# Altium project Zynq 7000 Demo.PrjPcb (part 5 of 9)

## Sheet [8] - Z7010 B34, AR238, MIPI.SchDoc: BANK 34, MIPI & AR238
size B; Organization: Altium Limited; Address1: L3, 12a Rodborough Rd; Address2: Frenchs Forest; Address3: NSW; Address4: Australia 2086; DocumentNumber: 8; Revision: V1I1; SheetNumber: 8; SheetTotal: 16
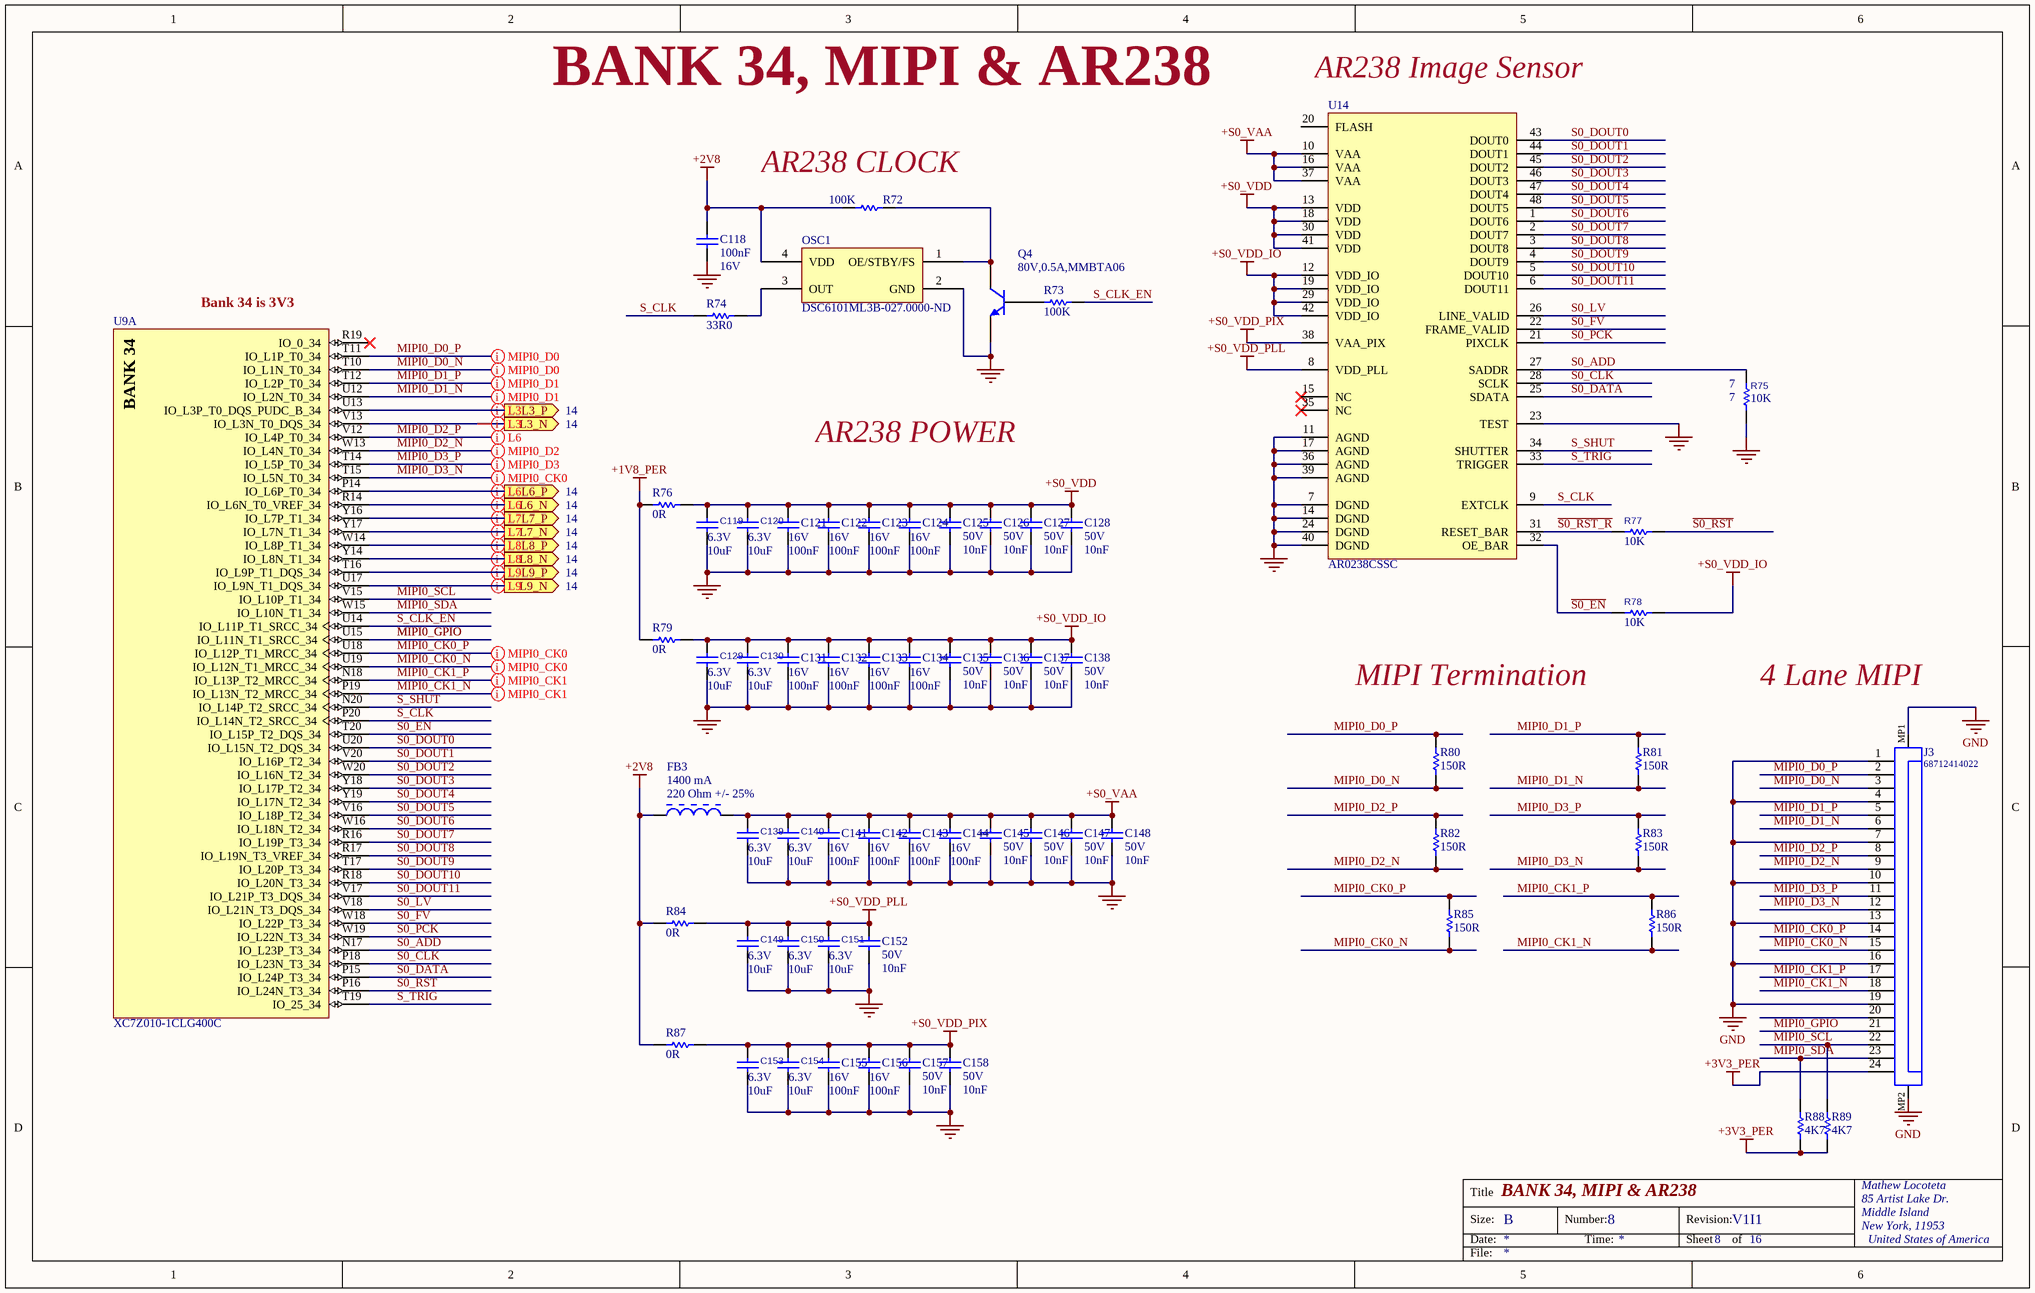
[diagram p7: [8] - Z7010 B34, AR238, MIPI.SchDoc]

### Parts
C118  Capacitance: 100nF  Voltage Rating: 16V  [C0402]  (hidden comment: 0.1uF,16V)
C119  Capacitance: 10uF  Voltage Rating: 6.3V  [C0603]  (hidden comment: 10uF,6V3)
C120  Capacitance: 10uF  Voltage Rating: 6.3V  [C0603]  (hidden comment: 10uF,6V3)
C121  Capacitance: 100nF  Voltage Rating: 16V  [C0402]  (hidden comment: 0.1uF,16V)
C122  Capacitance: 100nF  Voltage Rating: 16V  [C0402]  (hidden comment: 0.1uF,16V)
C123  Capacitance: 100nF  Voltage Rating: 16V  [C0402]  (hidden comment: 0.1uF,16V)
C124  Capacitance: 100nF  Voltage Rating: 16V  [C0402]  (hidden comment: 0.1uF,16V)
C125  Voltage Rating (DC): 50V  Capacitance: 10nF  [CAPC1005X55X25ML5T10]  (hidden comment: CC0402KRX7R9BB103)
C126  Voltage Rating (DC): 50V  Capacitance: 10nF  [CAPC1005X55X25ML5T10]  (hidden comment: CC0402KRX7R9BB103)
C127  Voltage Rating (DC): 50V  Capacitance: 10nF  [CAPC1005X55X25ML5T10]  (hidden comment: CC0402KRX7R9BB103)
C128  Voltage Rating (DC): 50V  Capacitance: 10nF  [CAPC1005X55X25ML5T10]  (hidden comment: CC0402KRX7R9BB103)
C129  Capacitance: 10uF  Voltage Rating: 6.3V  [C0603]  (hidden comment: 10uF,6V3)
C130  Capacitance: 10uF  Voltage Rating: 6.3V  [C0603]  (hidden comment: 10uF,6V3)
C131  Capacitance: 100nF  Voltage Rating: 16V  [C0402]  (hidden comment: 0.1uF,16V)
C132  Capacitance: 100nF  Voltage Rating: 16V  [C0402]  (hidden comment: 0.1uF,16V)
C133  Capacitance: 100nF  Voltage Rating: 16V  [C0402]  (hidden comment: 0.1uF,16V)
C134  Capacitance: 100nF  Voltage Rating: 16V  [C0402]  (hidden comment: 0.1uF,16V)
C135  Voltage Rating (DC): 50V  Capacitance: 10nF  [CAPC1005X55X25ML5T10]  (hidden comment: CC0402KRX7R9BB103)
C136  Voltage Rating (DC): 50V  Capacitance: 10nF  [CAPC1005X55X25ML5T10]  (hidden comment: CC0402KRX7R9BB103)
C137  Voltage Rating (DC): 50V  Capacitance: 10nF  [CAPC1005X55X25ML5T10]  (hidden comment: CC0402KRX7R9BB103)
C138  Voltage Rating (DC): 50V  Capacitance: 10nF  [CAPC1005X55X25ML5T10]  (hidden comment: CC0402KRX7R9BB103)
C139  Capacitance: 10uF  Voltage Rating: 6.3V  [C0603]  (hidden comment: 10uF,6V3)
C140  Capacitance: 10uF  Voltage Rating: 6.3V  [C0603]  (hidden comment: 10uF,6V3)
C141  Capacitance: 100nF  Voltage Rating: 16V  [C0402]  (hidden comment: 0.1uF,16V)
C142  Capacitance: 100nF  Voltage Rating: 16V  [C0402]  (hidden comment: 0.1uF,16V)
C143  Capacitance: 100nF  Voltage Rating: 16V  [C0402]  (hidden comment: 0.1uF,16V)
C144  Capacitance: 100nF  Voltage Rating: 16V  [C0402]  (hidden comment: 0.1uF,16V)
C145  Voltage Rating (DC): 50V  Capacitance: 10nF  [CAPC1005X55X25ML5T10]  (hidden comment: CC0402KRX7R9BB103)
C146  Voltage Rating (DC): 50V  Capacitance: 10nF  [CAPC1005X55X25ML5T10]  (hidden comment: CC0402KRX7R9BB103)
C147  Voltage Rating (DC): 50V  Capacitance: 10nF  [CAPC1005X55X25ML5T10]  (hidden comment: CC0402KRX7R9BB103)
C148  Voltage Rating (DC): 50V  Capacitance: 10nF  [CAPC1005X55X25ML5T10]  (hidden comment: CC0402KRX7R9BB103)
C149  Capacitance: 10uF  Voltage Rating: 6.3V  [C0603]  (hidden comment: 10uF,6V3)
C150  Capacitance: 10uF  Voltage Rating: 6.3V  [C0603]  (hidden comment: 10uF,6V3)
C151  Capacitance: 10uF  Voltage Rating: 6.3V  [C0603]  (hidden comment: 10uF,6V3)
C152  Voltage Rating (DC): 50V  Capacitance: 10nF  [CAPC1005X55X25ML5T10]  (hidden comment: CC0402KRX7R9BB103)
C153  Capacitance: 10uF  Voltage Rating: 6.3V  [C0603]  (hidden comment: 10uF,6V3)
C154  Capacitance: 10uF  Voltage Rating: 6.3V  [C0603]  (hidden comment: 10uF,6V3)
C155  Capacitance: 100nF  Voltage Rating: 16V  [C0402]  (hidden comment: 0.1uF,16V)
C156  Capacitance: 100nF  Voltage Rating: 16V  [C0402]  (hidden comment: 0.1uF,16V)
C157  Voltage Rating (DC): 50V  Capacitance: 10nF  [CAPC1005X55X25ML5T10]  (hidden comment: CC0402KRX7R9BB103)
C158  Voltage Rating (DC): 50V  Capacitance: 10nF  [CAPC1005X55X25ML5T10]  (hidden comment: CC0402KRX7R9BB103)
FB3  Rated Current: 1400 mA  Impedance (at 100 MHz): 220 Ohm +/- 25%  [MURA-BLM18PG_KG-CHIP-2_V2]  (hidden comment: BLM18PG221SN1D)
J3  68712414022  [68712414022]
OSC1  DSC6101ML3B-027.0000-ND  [4-VFLGA]
Q4  80V,0.5A,MMBTA06  [ONSC-SOT-23-3-318-08_V]
R72  100K  [R0402]
R73  100K  [R0402]
R74  33R0  [R0603]
R75  10K  [R0402]
R76  0R  [R0402]
R77  10K  [R0402]
R78  10K  [R0402]
R79  0R  [R0402]
R80  value 150R  [RESC1005X40X25LL05T05]  (hidden comment: CRCW0402150RFKED)
R81  value 150R  [RESC1005X40X25LL05T05]  (hidden comment: CRCW0402150RFKED)
R82  value 150R  [RESC1005X40X25LL05T05]  (hidden comment: CRCW0402150RFKED)
R83  value 150R  [RESC1005X40X25LL05T05]  (hidden comment: CRCW0402150RFKED)
R84  0R  [R0402]
R85  value 150R  [RESC1005X40X25LL05T05]  (hidden comment: CRCW0402150RFKED)
R86  value 150R  [RESC1005X40X25LL05T05]  (hidden comment: CRCW0402150RFKED)
R87  0R  [R0402]
R88  Resistance: 4K7  (hidden comment: 4K7 0402 1%)
R89  Resistance: 4K7  (hidden comment: 4K7 0402 1%)
U9  XC7Z010-1CLG400C  [CLG400]  (part A of 9)
U14  AR0238CSSC

### Ports
L3_N (out), L3_P (out), L6_N (out), L6_P (out), L7_N (out), L7_P (out), L8_N (out), L8_P (out), L9_N (out), L9_P (out)

### Nets
+1V8_PER: R76.1 R79.1
+2V8: C118.1 FB3.1 OSC1.4(VDD) R72.1 R84.1 R87.1
+3V3_PER: J3.24 R88.2 R89.2
+S0_VAA: C139.2 C140.2 C141.2 C142.2 C143.2 C144.2 C145.2 C146.2 C147.2 C148.2 FB3.2 U14.10(VAA) U14.16(VAA) U14.37(VAA)
+S0_VDD: C119.2 C120.2 C121.2 C122.2 C123.2 C124.2 C125.2 C126.2 C127.2 C128.2 R76.2 U14.13(VDD) U14.18(VDD) U14.30(VDD) U14.41(VDD)
+S0_VDD_IO: C129.2 C130.2 C131.2 C132.2 C133.2 C134.2 C135.2 C136.2 C137.2 C138.2 R78.2 R79.2 U14.12(VDD_IO) U14.19(VDD_IO) U14.29(VDD_IO) U14.42(VDD_IO)
+S0_VDD_PIX: C153.2 C154.2 C155.2 C156.2 C157.2 C158.2 R87.2 U14.38(VAA_PIX)
+S0_VDD_PLL: C149.2 C150.2 C151.2 C152.2 R84.2 U14.8(VDD_PLL)
GND: C118.2 C119.1 C120.1 C121.1 C122.1 C123.1 C124.1 C125.1 C126.1 C127.1 C128.1 C129.1 C130.1 C131.1 C132.1 C133.1 C134.1 C135.1 C136.1 C137.1 C138.1 C139.1 C140.1 C141.1 C142.1 C143.1 C144.1 C145.1 C146.1 C147.1 C148.1 C149.1 C150.1 C151.1 C152.1 C153.1 C154.1 C155.1 C156.1 C157.1 C158.1 J3.1 J3.4 J3.7 J3.10 J3.13 J3.16 J3.19 J3.MP1 J3.MP2 OSC1.2(GND) Q4.2(E) R75.1 U14.7(DGND) U14.11(AGND) U14.14(DGND) U14.17(AGND) U14.23(TEST) U14.24(DGND) U14.36(AGND) U14.39(AGND) U14.40(DGND)
L3_N: U9.V13(IO_L3N_T0_DQS_34) ; port L3_N
L3_P: U9.U13(IO_L3P_T0_DQS_PUDC_B_34) ; port L3_P
L6_N: U9.R14(IO_L6N_T0_VREF_34) ; port L6_N
L6_P: U9.P14(IO_L6P_T0_34) ; port L6_P
L7_N: U9.Y17(IO_L7N_T1_34) ; port L7_N
L7_P: U9.Y16(IO_L7P_T1_34) ; port L7_P
L8_N: U9.Y14(IO_L8N_T1_34) ; port L8_N
L8_P: U9.W14(IO_L8P_T1_34) ; port L8_P
L9_N: U9.U17(IO_L9N_T1_DQS_34) ; port L9_N
L9_P: U9.T16(IO_L9P_T1_DQS_34) ; port L9_P
MIPI0_CK0_N: J3.15 R85.1 U9.U19(IO_L12N_T1_MRCC_34)
MIPI0_CK0_P: J3.14 R85.2 U9.U18(IO_L12P_T1_MRCC_34)
MIPI0_CK1_N: J3.18 R86.1 U9.P19(IO_L13N_T2_MRCC_34)
MIPI0_CK1_P: J3.17 R86.2 U9.N18(IO_L13P_T2_MRCC_34)
MIPI0_D0_N: J3.3 R80.1 U9.T10(IO_L1N_T0_34)
MIPI0_D0_P: J3.2 R80.2 U9.T11(IO_L1P_T0_34)
MIPI0_D1_N: J3.6 R81.1 U9.U12(IO_L2N_T0_34)
MIPI0_D1_P: J3.5 R81.2 U9.T12(IO_L2P_T0_34)
MIPI0_D2_N: J3.9 R82.1 U9.W13(IO_L4N_T0_34)
MIPI0_D2_P: J3.8 R82.2 U9.V12(IO_L4P_T0_34)
MIPI0_D3_N: J3.12 R83.1 U9.T15(IO_L5N_T0_34)
MIPI0_D3_P: J3.11 R83.2 U9.T14(IO_L5P_T0_34)
MIPI0_GPIO: J3.21 U9.U15(IO_L11N_T1_SRCC_34)
MIPI0_SCL: J3.22 R89.1 U9.V15(IO_L10P_T1_34)
MIPI0_SDA: J3.23 R88.1 U9.W15(IO_L10N_T1_34)
S0_ADD: R75.2 U9.N17(IO_L23P_T3_34) U14.27(SADDR)
S0_CLK: U9.P18(IO_L23N_T3_34) U14.28(SCLK)
S0_DATA: U9.P15(IO_L24P_T3_34) U14.25(SDATA)
S0_DOUT0: U9.U20(IO_L15N_T2_DQS_34) U14.43(DOUT0)
S0_DOUT1: U9.V20(IO_L16P_T2_34) U14.44(DOUT1)
S0_DOUT2: U9.W20(IO_L16N_T2_34) U14.45(DOUT2)
S0_DOUT3: U9.Y18(IO_L17P_T2_34) U14.46(DOUT3)
S0_DOUT4: U9.Y19(IO_L17N_T2_34) U14.47(DOUT4)
S0_DOUT5: U9.V16(IO_L18P_T2_34) U14.48(DOUT5)
S0_DOUT6: U9.W16(IO_L18N_T2_34) U14.1(DOUT6)
S0_DOUT7: U9.R16(IO_L19P_T3_34) U14.2(DOUT7)
S0_DOUT8: U9.R17(IO_L19N_T3_VREF_34) U14.3(DOUT8)
S0_DOUT9: U9.T17(IO_L20P_T3_34) U14.4(DOUT9)
S0_DOUT10: U9.R18(IO_L20N_T3_34) U14.5(DOUT10)
S0_DOUT11: U9.V17(IO_L21P_T3_DQS_34) U14.6(DOUT11)
S0_FV: U9.W18(IO_L22P_T3_34) U14.22(FRAME_VALID)
S0_LV: U9.V18(IO_L21N_T3_DQS_34) U14.26(LINE_VALID)
S0_PCK: U9.W19(IO_L22N_T3_34) U14.21(PIXCLK)
~{S0_EN}: R78.1 U9.T20(IO_L15P_T2_DQS_34) U14.32(OE_BAR)
~{S0_RST}: R77.2 U9.P16(IO_L24N_T3_34)
~{S0_RST_R}: R77.1 U14.31(RESET_BAR)
S_CLK: R74.1 U9.P20(IO_L14N_T2_SRCC_34) U14.9(EXTCLK)
S_CLK_EN: R73.2 U9.U14(IO_L11P_T1_SRCC_34)
S_SHUT: U9.N20(IO_L14P_T2_SRCC_34) U14.34(SHUTTER)
S_TRIG: U9.T19(IO_25_34) U14.33(TRIGGER)
NetOSC1_1: OSC1.1(OE/STBY/FS) Q4.3(C) R72.2
NetOSC1_3: OSC1.3(OUT) R74.2
NetQ4_1: Q4.1(B) R73.1

Not connected (* = marked no-connect by the designer): J3 20; U9 R19(IO_0_34)*; U14 15(NC)* 20(FLASH) 35(NC)*

### Layout directives
differential pair: L3_N, L3_P, L6_N, L6_P, L7_N, L7_P, L8_N, L8_P, L9_N, L9_P, MIPI0_CK0_N, MIPI0_CK0_P, MIPI0_CK1_N, MIPI0_CK1_P, MIPI0_D0_N, MIPI0_D0_P, MIPI0_D1_N, MIPI0_D1_P, MIPI0_D2_N, MIPI0_D2_P, MIPI0_D3_N, MIPI0_D3_P

### Notes on the sheet
- BANK 34, MIPI & AR238
- (near U14) AR238 Image Sensor
- (near R72) AR238 CLOCK
- (near U9) Bank 34 is 3V3
- 14
- (near R75) 7
- AR238 POWER
- MIPI Termination
- 4 Lane MIPI
- Title
- Size:
- Date:
- B
- Number:
- Time:
- Revision:
- Sheet
- of
- Mathew Locoteta
- 85 Artist Lake Dr.
- Middle Island
- New York, 11953
- United States of America
- File:
- (in symbol CMP-0363-00007-3, part A) BANK 34

### Library data of the parts
C118 C121-C124 C131-C134 C141-C144 C155 C156 = CL05B104KO5VPNC: CAP CER 0.1UF 16V X7R 0402; Manufacturer: Samsung; Tolerance: 10%; Supplier 1: Digi-Key; Manufacturer Part Number: CL05B104KO5VPNC; Stock 1: 940680; Pricing 1: 1=0.10000, 10=0.02600, 100=0.01140, 500=0.00812, 1000=0.00638, 2500=0.00580, 5000=0.00534 (USD); RoHS: Yes; Mount: Surface Mount; Case/Package: 0402; Case Code (Metric): 1005; Case Code (Imperial): 0402; Min Operating Temperature: -55°C; Max Operating Temperature: 125°C; Packaging: Cut Tape; Features: Soft Termination; Length: 0.039inch; Width: 0.02inch; Thickness: 0.022inch; Ratings: AEC-Q200; Lead Free: Lead Free; ComponentLink1URL: http://components.arrow.com/part/dataview/0323_06933256?src-supplier=Arrow+Europe; ComponentLink1Description: http://components.arrow.com/part/dataview/0323_06933256?src-supplier=Arrow+Europe; ComponentLink2URL: http://www.samsungsem.com/kr/support/library/product-catalog/mlcc.jsp?src-supplier=Digi-Key; ComponentLink2Description: http://www.samsungsem.com/kr/support/library/product-catalog/mlcc.jsp?src-supplier=Digi-Key; ComponentLink3URL: http://www.farnell.com/datasheets/2710692.pdf?src-supplier=Newark; ComponentLink3Description: http://www.farnell.com/datasheets/2710692.pdf?src-supplier=Newark; ComponentLink4URL: http://www.samsungsem.com/kr/support/product-search/mlcc/CL05B104KO5VPNC.jsp?src-supplier=Digi-Key; ComponentLink4Description: http://www.samsungsem.com/kr/support/product-search/mlcc/CL05B104KO5VPNC.jsp?src-supplier=Digi-Key; ComponentLink5URL: http://www.samsungsem.com/servlet/FileDownload?type=spec&file=CL05B104KO5VPNC.pdf&src-supplier=Avnet; ComponentLink5Description: http://www.samsungsem.com/servlet/FileDownload?type=spec&file=CL05B104KO5VPNC.pdf&src-supplier=Avnet; Supplier Part Number 1: 1276-6844-1-ND
C119 C120 C129 C130 C139 C140 C149-C151 C153 C154 = JMK107ABJ106MAHT: CAP CER 10UF 6.3V X5R 0603; Manufacturer: Taiyo Yuden; Tolerance: 20%; Supplier 1: Digi-Key; Manufacturer Part Number: JMK107ABJ106MAHT; Stock 1: 454858; Pricing 1: 1=0.20000, 10=0.13700, 100=0.06920, 500=0.04736, 1000=0.04190 (USD); RoHS: Yes; Mount: Surface Mount; Case/Package: 0603; Case Code (Imperial): 0603; Case Code (Metric): 1608; Contact Plating: Tin; Min Operating Temperature: -55°C; Max Operating Temperature: 85°C; Packaging: Tape and Reel; Voltage Rating (DC): 6.3V; Package Quantity: 4000; Dielectric: X5R; Termination: SMD/SMT; Length: 1.6mm; Height: 0.8mm; Width: 0.8mm; Thickness: 0.035inch; Ratings: AEC-Q200; Lead Free: Lead Free; Halogen Free: Halogen Free; ComponentLink1URL: https://datasheet.ciiva.com/18697/mlcc01-hq-e-18697804.pdf?src-supplier=Digi-Key; ComponentLink1Description: https://datasheet.ciiva.com/18697/mlcc01-hq-e-18697804.pdf?src-supplier=Digi-Key; ComponentLink2URL: https://datasheet.ciiva.com/18697/mlcc01-hq-e-18697806.pdf?src-supplier=Digi-Key; ComponentLink2Description: https://datasheet.ciiva.com/18697/mlcc01-hq-e-18697806.pdf?src-supplier=Digi-Key; ComponentLink3URL: https://datasheet.ciiva.com/18697/mlcc01-hq-e-18697805.pdf?src-supplier=Digi-Key; ComponentLink3Description: https://datasheet.ciiva.com/18697/mlcc01-hq-e-18697805.pdf?src-supplier=Digi-Key; Supplier Part Number 1: 587-3383-1-ND
C125-C128 C135-C138 C145-C148 C152 C157 C158 = CMP-2100-03592-1: Chip Capacitor, 10 nF, +/- 10%, 50 V, -55 to 125 degC, 0402 (1005 Metric), RoHS, Tape and Reel; Manufacturer: Yageo; Dielectric: X7R; Package Description: 2-Pin Surface Mount Device, Body 1 x 0.5 mm; REACH SVHC: NoSVHC; Depth: 0.5mm; Length: 1mm; Tolerance: 10%; Radiation Hardening: No; Thickness: 0.022inch; Lead Free: LeadFree; Height: 0.5mm; Packaging: TapeandReel; RoHSCompliant: True; Termination: SMD/SMT; Min Operating Temperature: -55degC; Composition: Ceramic; Case Code (Metric): 1005; Voltage Rating: 50V; Case Code (Imperial): 0402; Mount: SurfaceMount; Package Reference: 0402; Voltage: 50V; Manufacturer URL: http://www.yageo.com/; Width: 0.5mm; Package Quantity: 1; Datasheet Version: Rev. 15, 10/2016; Max Operating Temperature: 125degC; Datasheet URL: http://www.yageo.com/documents/recent/UPY-GPHC_X7R_6.3V-to-50V_15.pdf; Case/Package: 0402
FB3 = CMP-0686-00569-2: Chip Ferrite Bead for Power Lines, 220 Ohm, 1400 mA, -55 to 125 degC, 1.6 x 0.8 x 0.95 mm SMD, Tape and Reel; Manufacturer: Murata; DC Resistance: 0.10 Ohm Max.; ComponentLink2URL: http://www.murata.com/products/catalog/pdf/c31e.pdf; Packing: Tape and Reel; ComponentLink3URL: http://www.murata.com/products/catalog/pdf/c31e.pdf; PackageDescription: 2-Pin Chip, Body 1.6 x 0.8 mm; ComponentLink1Description: Manufacturer URL; ComponentLink2Description: Datasheet; Operating Temperature Range: -55 to 125 degC; DatasheetVersion: 08/2013; PackageReference: BLM18_H950-2; Mounting Technology: Surface Mount; ComponentLink1URL: http://www.murata.com/; ComponentLink3Description: Package Specification; PartNumber: BLM18PG221SN1D
J3 = CMP-1502-01558-1: SMT ZIF Connectors WR-FPC, Horizontal, Top Contact, pitch 0.5 mm, 24 pins; Manufacturer: Wurth Elektronik; Rated Current: 0.5A; Pin Number: 24; Pitch: 0.5mm; Working Voltage: 50VAC; Contact Resistance: 20mOhm; Withstanding Voltage: 250VAC; Packaging: TapeandReel; Operating Temperature: -25to85degC; Manufacturer URL: http://www.we-online.de; Mounting Technology: SMT; Package Reference: 68712414022; Orientation: Horizontal; Datasheet URL: https://katalog.we-online.de/em/datasheet/68712414022.pdf; Contact Design: TopContact; Part Number: 68712414022; Publisher: WurthElektronik
OSC1 = DSC6101CI2A-027.0000: ULTRA-LOW POWER,MEMS OSCILLATOR, / DSC6101ML3B-027.0000-ND / USE B VERSION 4-VFLGA 2MMx1.6MM; Manufacturer: Microchip; Frequency: 27MHz; Max Supply Current: 3mA; Frequency Stability: 25ppm; Manufacturer Part Number: DSC6101CI2A-027.0000; RoHS: Yes; Mount: Surface Mount; Case/Package: SMD/SMT; Min Operating Temperature: -40°C; Max Operating Temperature: 85°C; Packaging: Rail/Tube; Length: 0.126inch; Height: 0.035inch; Width: 0.098inch; Ratings: AEC-Q100; ComponentLink1URL: http://www.microchip.com/mymicrochip/filehandler.aspx?ddocname=en587492&src-supplier=Digi-Key; ComponentLink1Description: http://www.microchip.com/mymicrochip/filehandler.aspx?ddocname=en587492&src-supplier=Digi-Key; Supplier 1: Mouser; Supplier Part Number 1: 579-6101ML3B0270000
Q4 = MMBTA06LT1G: TRANS NPN 80V 0.5A SOT23; Manufacturer: ON Semiconductor; Max Power Dissipation: 225mW; Number of Elements: 1; Frequency: 100MHz; Emitter Base Voltage (VEBO): 4V; Collector Emitter Saturation Voltage: 250mV; Max Collector Current: 500mA; Power Dissipation: 300mW; Element Configuration: Single; hFE Min: 100; Supplier 1: Digi-Key; Manufacturer Part Number: MMBTA06LT1G; Stock 1: 502614; Pricing 1: 1=0.19000, 10=0.17000, 100=0.09230, 500=0.05682, 1000=0.03874 (USD); RoHS: Yes; Case/Package: SOT-23-3; Number of Pins: 3; Contact Plating: Tin,Matte; Min Operating Temperature: -55°C; Max Operating Temperature: 150°C; Package Quantity: 1; Collector Emitter Voltage (VCEO): 80V; Packaging: Tape and Reel; Polarity: NPN; Collector Base Voltage (VCBO): 80V; Collector Emitter Breakdown Voltage: 80V; Transition Frequency: 100MHz; Max Breakdown Voltage: 80V; Max Frequency: 100MHz; Gain Bandwidth Product: 100MHz; Voltage Rating (DC): 80V; Current Rating: 500mA; Length: 0.119inch; Height: 0.04inch; Width: 0.055inch; Radiation Hardening: No; REACH SVHC: No SVHC; Lead Free: Lead Free; ComponentLink1URL: https://datasheet.ciiva.com/4722/mmbta05lt1-d-101659-4722113.pdf?src-supplier=Mouser; ComponentLink1Description: https://datasheet.ciiva.com/4722/mmbta05lt1-d-101659-4722113.pdf?src-supplier=Mouser; ComponentLink2URL: https://datasheet.ciiva.com/15139/getdatasheetpartid-137838-15139444.pdf?src-supplier=Verical; ComponentLink2Description: https://datasheet.ciiva.com/15139/getdatasheetpartid-137838-15139444.pdf?src-supplier=Verical; ComponentLink3URL: https://datasheet.ciiva.com/11197/mmbta05lt1-d-11197414.pdf?src-supplier=Avnet; ComponentLink3Description: https://datasheet.ciiva.com/11197/mmbta05lt1-d-11197414.pdf?src-supplier=Avnet; ComponentLink4URL: https://datasheet.ciiva.com/976/mmbta05lt1-d-976473.pdf?src-supplier=Digi-Key; ComponentLink4Description: https://datasheet.ciiva.com/976/mmbta05lt1-d-976473.pdf?src-supplier=Digi-Key; ComponentLink5URL: https://datasheet.ciiva.com/976/mmbta05lt1-d-976474.pdf?src-supplier=Digi-Key; ComponentLink5Description: https://datasheet.ciiva.com/976/mmbta05lt1-d-976474.pdf?src-supplier=Digi-Key; ComponentLink6URL: https://datasheet.ciiva.com/25998/mmbta05lt1-d-25998830.pdf?src-supplier=Avnet+Europe; ComponentLink6Description: https://datasheet.ciiva.com/25998/mmbta05lt1-d-25998830.pdf?src-supplier=Avnet+Europe; ComponentLink7URL: https://datasheet.ciiva.com/16465/mmbta05lt1-d-16465685.pdf?src-supplier=Future+Electronics; ComponentLink7Description: https://datasheet.ciiva.com/16465/mmbta05lt1-d-16465685.pdf?src-supplier=Future+Electronics; ComponentLink8URL: https://datasheet.ciiva.com/11198/mmbta05lt1-d-11198678.pdf?src-supplier=Avnet; ComponentLink8Description: https://datasheet.ciiva.com/11198/mmbta05lt1-d-11198678.pdf?src-supplier=Avnet; ComponentLink9URL: https://datasheet.ciiva.com/976/mmbta05lt1-d-976475.pdf?src-supplier=Digi-Key; ComponentLink9Description: https://datasheet.ciiva.com/976/mmbta05lt1-d-976475.pdf?src-supplier=Digi-Key; ComponentLink10URL: https://datasheet.ciiva.com/7972/mmbta05lt1-d-7972078.pdf?src-supplier=Element14; ComponentLink10Description: https://datasheet.ciiva.com/7972/mmbta05lt1-d-7972078.pdf?src-supplier=Element14; ComponentLink11URL: https://datasheet.ciiva.com/16478/mmbta05lt1-d-16478574.pdf?src-supplier=Avnet+Asia; ComponentLink11Description: https://datasheet.ciiva.com/16478/mmbta05lt1-d-16478574.pdf?src-supplier=Avnet+Asia; Supplier Part Number 1: MMBTA06LT1GOSCT-ND
R72 R73 = RMCF0402FT100K: RES 100K OHM 1% 1/16W 0402; Manufacturer: Stackpole Electronics; Resistance: 100kR; Power Rating: 62.5mW; Temperature Coefficient: 100ppm/°C; Max Power Dissipation: 63mW; Supplier 1: Digi-Key; Manufacturer Part Number: RMCF0402FT100K; Stock 1: 1382397; Pricing 1: 1=0.10000, 10=0.01500, 100=0.00610, 1000=0.00275, 2500=0.00239, 5000=0.00198 (USD); RoHS: Yes; Mount: Surface Mount; Case/Package: 0402; Case Code (Metric): 1005; Case Code (Imperial): 0402; Contact Plating: Tin,Matte; Min Operating Temperature: -55°C; Max Operating Temperature: 155°C; Tolerance: 1%; Packaging: Tape and Reel; Composition: Thick Film; Number of Terminations: 2; Military Standard: Not; Features: Automotive AEC-Q200; Length: 1mm; Height: 0.016inch; Width: 0.02inch; Depth: 0.5mm; Radiation Hardening: No; Lead Free: Lead Free; ComponentLink1URL: https://datasheet.ciiva.com/15193/getdatasheetpartid-482656-15193415.pdf?src-supplier=Verical; ComponentLink1Description: https://datasheet.ciiva.com/15193/getdatasheetpartid-482656-15193415.pdf?src-supplier=Verical; Supplier Part Number 1: RMCF0402FT100KCT-ND
R74 = RMCF0603FT33R0: RES 33 OHM 1% 1/10W 0603; Manufacturer: Stackpole Electronics; Resistance: 33R; Max Power Dissipation: 100mW; Temperature Coefficient: 100ppm/°C; Supplier 1: Digi-Key; Manufacturer Part Number: RMCF0603FT33R0; Stock 1: 65395; Pricing 1: 1=0.10000, 10=0.01700, 100=0.00680, 1000=0.00306, 2500=0.00266 (USD); RoHS: Yes; Mount: Surface Mount; Case/Package: 0603; Case Code (Metric): 1608; Case Code (Imperial): 0603; Contact Plating: Tin,Matte; Min Operating Temperature: -55°C; Max Operating Temperature: 155°C; Package Quantity: 5000; Packaging: Tape and Reel; Tolerance: 1%; Composition: Thick Film; Number of Terminations: 2; Features: Automotive AEC-Q200; Length: 0.061inch; Height: 0.022inch; Width: 0.031inch; Radiation Hardening: No; ComponentLink1URL: http://components.arrow.com/part/dataview/40959996S7670686N1174?src-supplier=Arrow; ComponentLink1Description: http://components.arrow.com/part/dataview/40959996S7670686N1174?src-supplier=Arrow; ComponentLink2URL: https://www.seielect.com/catalog/SEI-Packaging.pdf?src-supplier=Digi-Key; ComponentLink2Description: https://www.seielect.com/catalog/SEI-Packaging.pdf?src-supplier=Digi-Key; ComponentLink3URL: https://www.seielect.com/catalog/SEI-RMCF_RMCP.pdf?src-supplier=Avnet; ComponentLink3Description: https://www.seielect.com/catalog/SEI-RMCF_RMCP.pdf?src-supplier=Avnet; ComponentLink4URL: https://www.seielect.com/Catalog/SEI-RMCF_RMCP.pdf?src-supplier=Digi-Key; ComponentLink4Description: https://www.seielect.com/Catalog/SEI-RMCF_RMCP.pdf?src-supplier=Digi-Key; Supplier Part Number 1: RMCF0603FT33R0CT-ND
R75 R77 R78 = RMCF0402FT10K0: RES 10K OHM 1% 1/16W 0402; Manufacturer: Stackpole Electronics; Resistance: 10kR; Power Rating: 62.5mW; Temperature Coefficient: 100ppm/°C; Max Power Dissipation: 63mW; Supplier 1: Digi-Key; Manufacturer Part Number: RMCF0402FT10K0; Stock 1: 6276240; Pricing 1: 1=0.10000, 10=0.01500, 100=0.00610, 1000=0.00275, 2500=0.00239, 5000=0.00198 (USD); RoHS: Yes; Mount: Surface Mount; Case/Package: 0402; Case Code (Metric): 1005; Case Code (Imperial): 0402; Contact Plating: Tin,Matte; Min Operating Temperature: -55°C; Max Operating Temperature: 155°C; Tolerance: 1%; Packaging: Tape and Reel; Composition: Thick Film; Number of Terminations: 2; Military Standard: Not; Features: Automotive AEC-Q200; Length: 1mm; Height: 0.016inch; Width: 0.02inch; Depth: 0.5mm; Radiation Hardening: No; Lead Free: Lead Free; ComponentLink1URL: https://datasheet.ciiva.com/24341/sei-rmcp-24341800.pdf?src-supplier=Onlinecomponents.com; ComponentLink1Description: https://datasheet.ciiva.com/24341/sei-rmcp-24341800.pdf?src-supplier=Onlinecomponents.com; Supplier Part Number 1: RMCF0402FT10K0DKR-ND
R76 R79 R84 R87 = RMCF0402ZT0R00: RES 0 OHM JUMPER 1/16W 0402; Manufacturer: Stackpole Electronics; Max Power Dissipation: 63mW; Current Rating: 1A; Working Voltage: 50V; Resistance: 0mR; Supplier 1: Digi-Key; Manufacturer Part Number: RMCF0402ZT0R00; RoHS: Yes; Category: Chip SMD Resistors; Stock 1: 3707577; Pricing 1: 1=0.10000, 10=0.01100, 25=0.00800, 50=0.00620, 100=0.00450, 250=0.00348, 500=0.00278, 1000=0.00204, 5000=0.00146 (USD); Mount: Surface Mount; Case/Package: 0402; Contact Plating: Tin,Matte; Case Code (Metric): 1005; Case Code (Imperial): 0402; Min Operating Temperature: -55°C; Max Operating Temperature: 155°C; Composition: Thick Film; Number of Terminations: 2; Military Standard: Not; Power Rating: 63mW; Packaging: Tape and Reel; Features: Automotive AEC-Q200; Length: 0.039inch; Height: 0.016inch; Depth: 0.5mm; Width: 0.02inch; Radiation Hardening: No; Lead Free: Lead Free; ComponentLink1URL: https://datasheet.ciiva.com/26835/getdatasheetpartid-409751-26835612.pdf?src-supplier=Verical; ComponentLink1Description: https://datasheet.ciiva.com/26835/getdatasheetpartid-409751-26835612.pdf?src-supplier=Verical; Supplier Part Number 1: RMCF0402ZT0R00DKR-ND
R80-R83 R85 R86 = CMP-2002-08214-1: Manufacturer: Vishay Dale; Part Number: CRCW0402150RFKED
R88 R89 = CRCW04024K70FKED: Resistor SMD 4.7 kOhm 0402 PU=10000 ST, CRCW04024K70FKED, Vishay; Power Rating: 63mW; Temperature Coefficient: 100ppm/°C; Voltage Rating: 50V; Supplier 1: Digi-Key; Manufacturer: Vishay; Manufacturer Part Number: CRCW04024K70FKED; RoHS: Yes; Category: Chip SMD Resistors; Stock 1: 575743; Pricing 1: 1=0.10000, 10=0.03500, 100=0.01410, 1000=0.00633, 2500=0.00550, 5000=0.00454 (USD); Mount: Surface Mount; Case/Package: 0402; Weight: 2.3E-05oz; Contact Plating: Tin; Case Code (Imperial): 0402; Case Code (Metric): 1005; Min Operating Temperature: -55°C; Max Operating Temperature: 155°C; Tolerance: 1%; Composition: Thick Film; Packaging: Tape and Reel; Package Quantity: 10; Termination: SMD/SMT; Military Standard: Not; Voltage Rating (DC): 50V; Number of Terminations: 2; Max Power Dissipation: 63mW; Features: Automotive AEC-Q200; Length: 1mm; Height: 0.35mm; Width: 0.5mm; Depth: 0.5mm; Radiation Hardening: No; Lead Free: Lead Free; REACH SVHC: Unknown; ComponentLink1URL: https://datasheet.ciiva.com/11808/0900766b80d98824-11808622.pdf?src-supplier=RSComponents; ComponentLink1Description: https://datasheet.ciiva.com/11808/0900766b80d98824-11808622.pdf?src-supplier=RSComponents; ComponentLink2URL: https://datasheet.ciiva.com/3256/dcrcwe3-3256597.pdf?src-supplier=Avnet; ComponentLink2Description: https://datasheet.ciiva.com/3256/dcrcwe3-3256597.pdf?src-supplier=Avnet; ComponentLink3URL: https://datasheet.ciiva.com/5550/dcrcwe3-109170-5550295.pdf?src-supplier=Mouser; ComponentLink3Description: https://datasheet.ciiva.com/5550/dcrcwe3-109170-5550295.pdf?src-supplier=Mouser; ComponentLink4URL: https://datasheet.ciiva.com/16764/70201119-16764281.pdf?src-supplier=Allied+Electronics; ComponentLink4Description: https://datasheet.ciiva.com/16764/70201119-16764281.pdf?src-supplier=Allied+Electronics; ComponentLink5URL: https://datasheet.ciiva.com/2463/dcrcwe3-2463034.pdf?src-supplier=Digi-Key; ComponentLink5Description: https://datasheet.ciiva.com/2463/dcrcwe3-2463034.pdf?src-supplier=Digi-Key; ComponentLink6URL: https://datasheet.ciiva.com/16881/dcrcwe3-16881690.pdf?src-supplier=Avnet+Europe; ComponentLink6Description: https://datasheet.ciiva.com/16881/dcrcwe3-16881690.pdf?src-supplier=Avnet+Europe; ComponentLink7URL: https://datasheet.ciiva.com/2463/dcrcwe3-2463035.pdf?src-supplier=Digi-Key; ComponentLink7Description: https://datasheet.ciiva.com/2463/dcrcwe3-2463035.pdf?src-supplier=Digi-Key; ComponentLink8URL: https://datasheet.ciiva.com/8079/1697337-8079643.pdf?src-supplier=Element14; ComponentLink8Description: https://datasheet.ciiva.com/8079/1697337-8079643.pdf?src-supplier=Element14; ComponentLink9URL: https://datasheet.ciiva.com/2463/dcrcwe3-2463036.pdf?src-supplier=Digi-Key; ComponentLink9Description: https://datasheet.ciiva.com/2463/dcrcwe3-2463036.pdf?src-supplier=Digi-Key; ComponentLink10URL: https://datasheet.ciiva.com/26316/fld-crcw-e3-data-en-26316654.pdf?src-supplier=Distrelec; ComponentLink10Description: https://datasheet.ciiva.com/26316/fld-crcw-e3-data-en-26316654.pdf?src-supplier=Distrelec; Supplier Part Number 1: 541-4.70KLCT-ND
U9 = CMP-0363-00007-3: 667 MHz Zynq™-7000 AP SoC, 130 PS I/O, 100 FPGA I/O, 400-Ball BGA, Speed Grade 1, Commercial Grade, Pb-Free; Flip Flops: 35200; Speed Grade: -1; LUTs: 17600; Extensible Block RAM (# 36Kb Blocks): 240 KB (60); ComponentLink6Description: PCB and Layout Guide; ComponentLink3Description: DC and AC Switching Characteristics; ComponentLink2URL: http://www.xilinx.com/support/documentation/user_guides/ug865-Zynq-7000-Pkg-Pinout.pdf; PackageReference: CLG400; ComponentLink3URL: http://www.xilinx.com/support/documentation/data_sheets/ds187-XC7Z010-XC7Z020-Data-Sheet.pdf; DatasheetVersion: v1.2; Generic Part Number: XC7Z010; ComponentLink2Description: Package Specification; ComponentLink1Description: Datasheet; PartNumber: XC7Z010-1CLG400C; ComponentLink5Description: Packaging and Pinout; Code_JEDEC: MO-275-MMAA-1; RoHS: Pb-Free; ComponentLink5URL: http://www.xilinx.com/support/documentation/user_guides/ug865-Zynq-7000-Pkg-Pinout.pdf; ComponentLink1URL: http://www.xilinx.com/support/documentation/data_sheets/ds190-Zynq-7000-Overview.pdf; ComponentLink4Description: Package File; ComponentLink4URL: http://www.xilinx.com/support/packagefiles/z7packages/xc7z010clg400pkg.txt; PackageDescription: Wire-Bond Chip-Scale BGA, Body 17 x 17 mm, 0.8 mm Pitch; PackageVersion: Rev 1.1, 09/2012; Mounting Technology: Surface Mount; ComponentLink6URL: http://www.xilinx.com/support/documentation/user_guides/ug483_7Series_PCB.pdf
U14 = AR0238CSSC12SPRA0-DR1: Manufacturer: ON Semiconductor; Supplier 1: Avnet; Manufacturer Part Number: AR0238CSSC12SPRA0-DR1; RoHS: No; Pricing 1: 152=6.66662, 304=6.62333, 608=6.53841, 912=6.45565, 1520=6.29625 (USD); Supplier Part Number 1: AR0238CSSC12SPRA0-DR1